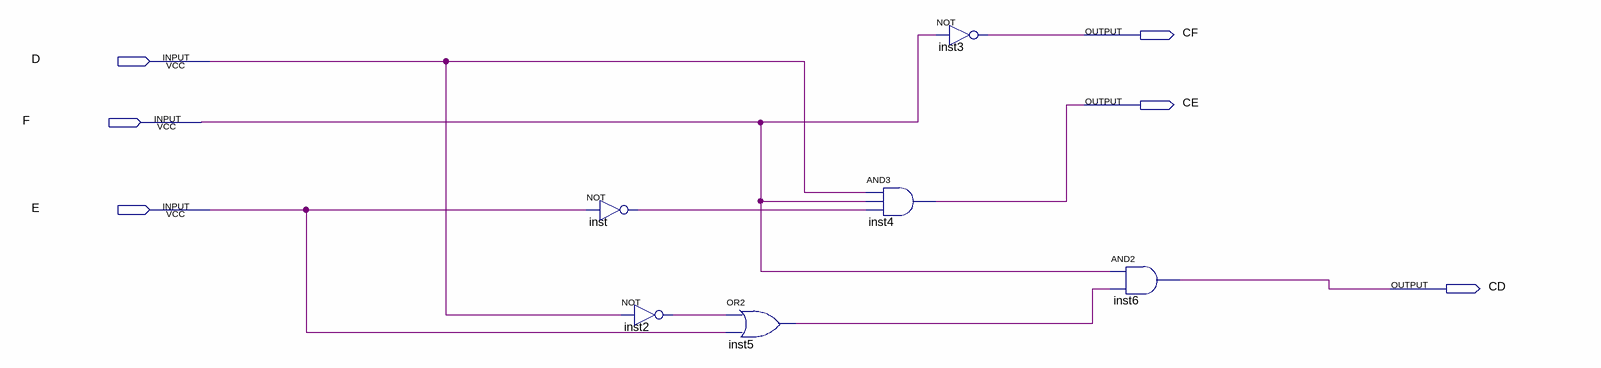
[diagram p0: schematic sheet]
// Quartus schematic aula03.bdf as structural Verilog: 6 symbols, 6 pins
module aula03 (
  input  D,
  input  F,
  input  E,
  output CF,
  output CE,
  output CD
);

  wire inst2_out, inst5_out, inst_out;

  not inst (inst_out, E);
  not inst2 (inst2_out, D);
  or inst5 (inst5_out, inst2_out, E);
  and inst4 (CE, D, F, inst_out);
  not inst3 (CF, F);
  and inst6 (CD, F, inst5_out);
endmodule
